# Altium schematic sheet DCU1.SchDoc
size B
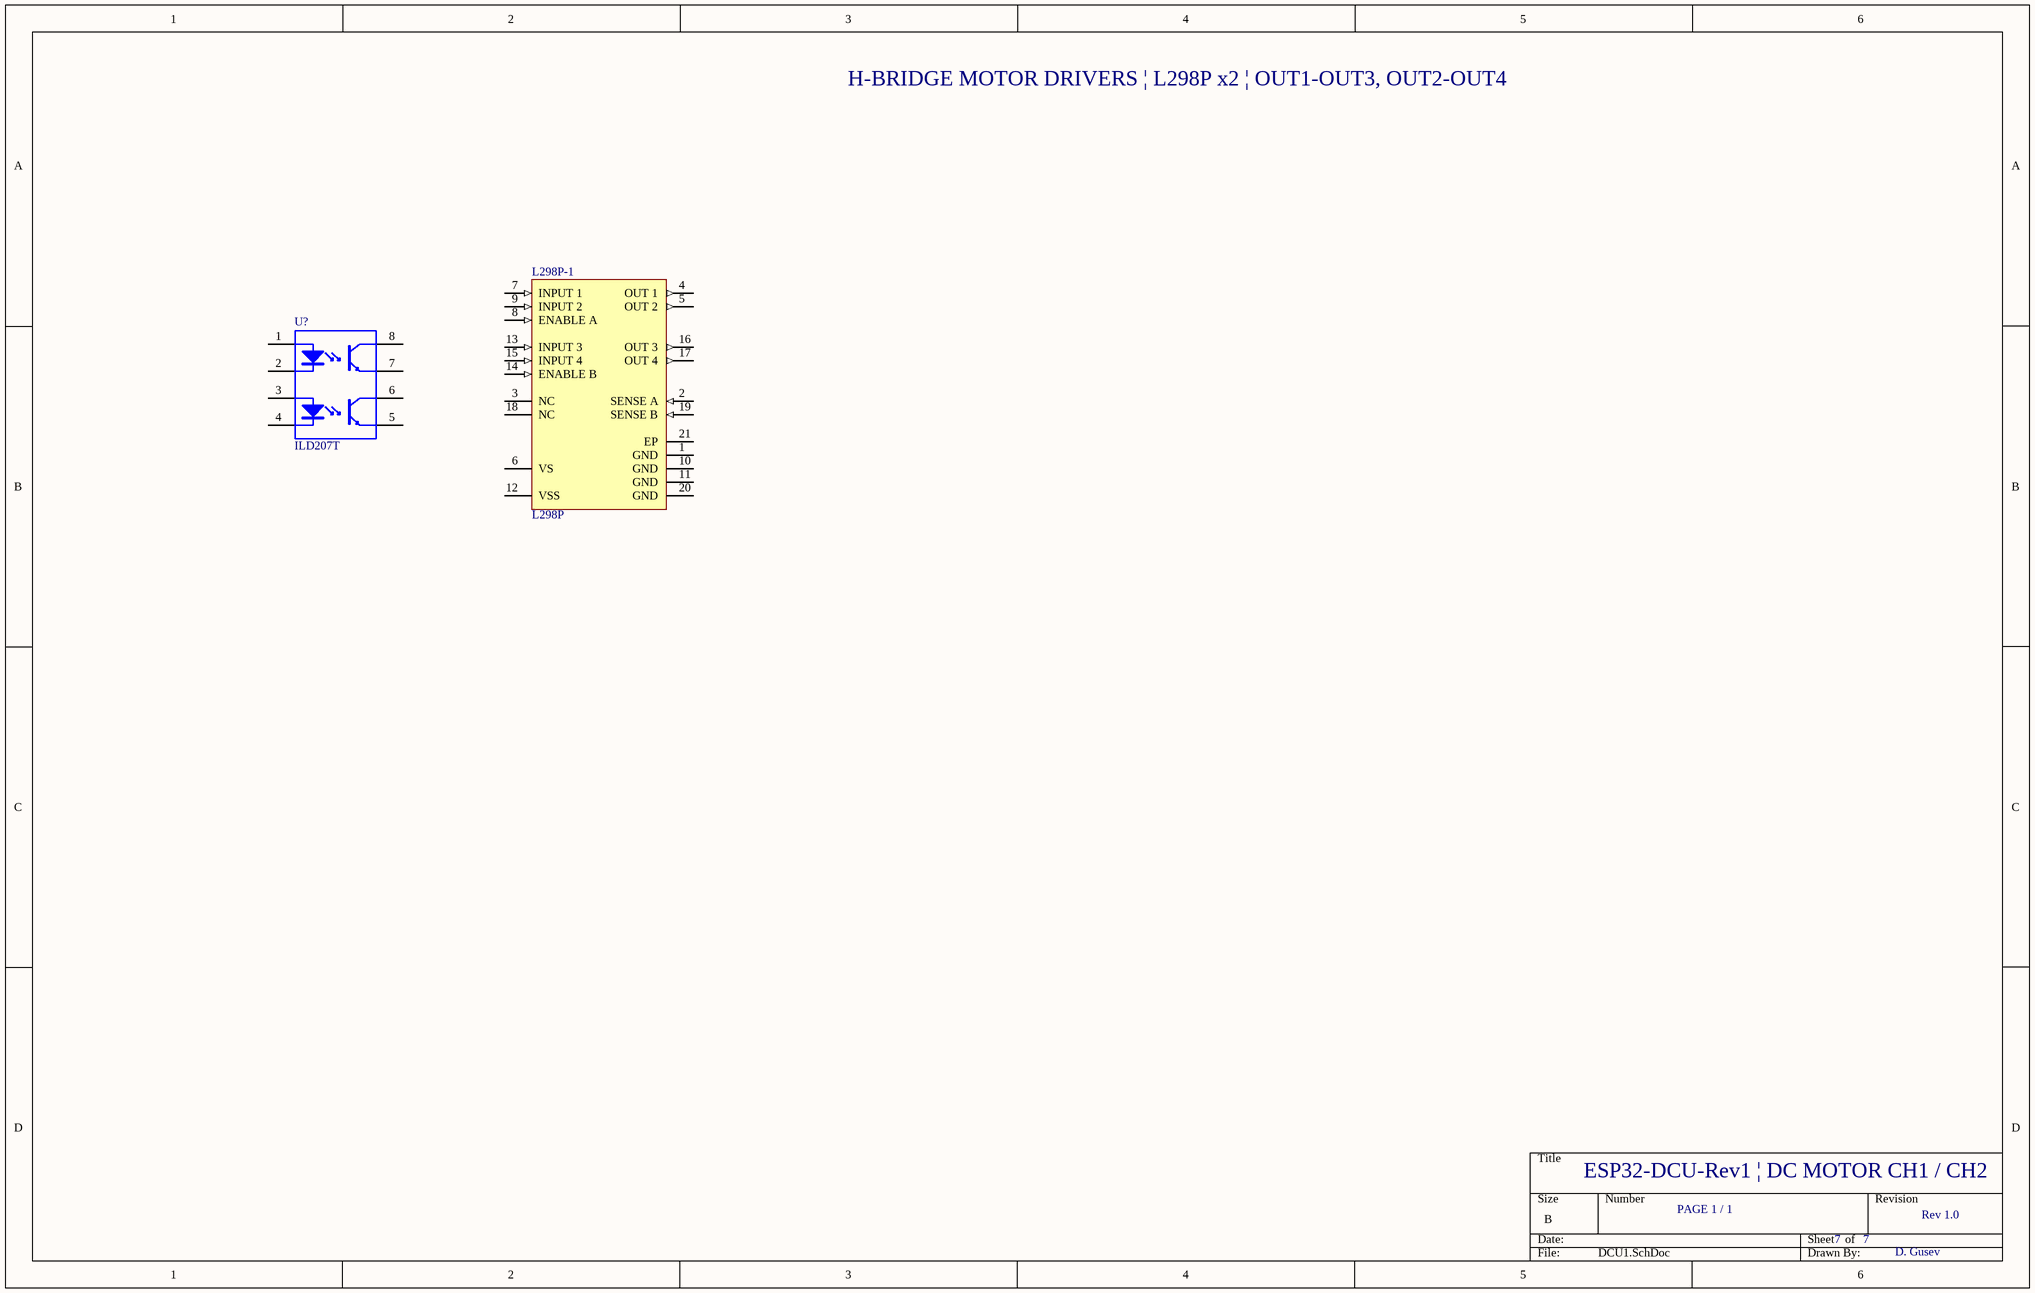
[diagram p0: DCU1.SchDoc]

## Parts
L298P-1  L298P  [STM-PowerSO20_M]
U?  ILD207T  [VISH-SOIC-8_C_V]

## Nets

Not connected (* = marked no-connect by the designer): L298P-1 1(GND) 2(SENSE_A) 3(NC) 4(OUT_1) 5(OUT_2) 6(VS) 7(INPUT_1) 8(ENABLE_A) 9(INPUT_2) 10(GND) 11(GND) 12(VSS) 13(INPUT_3) 14(ENABLE_B) 15(INPUT_4) 16(OUT_3) 17(OUT_4) 18(NC) 19(SENSE_B) 20(GND) 21(EP); U? 1(A) 2(K) 3(A) 4(K) 5(E) 6(C) 7(E) 8(C)

## Notes on the sheet
- H-BRIDGE MOTOR DRIVERS | L298P x2 | OUT1-OUT3, OUT2-OUT4
- ESP32-DCU-Rev1 | DC MOTOR CH1 / CH2
- PAGE 1 / 1
- 7
- Rev 1.0
- D. Gusev

## Library data of the parts
L298P-1 = CMP-2100-03649-1: Dual Full-Bridge Driver, 4.5 to 7 V, -25 to 130 degC, 20-Pin SOIC, RoHS, Tube; Manufacturer: STMicroelectronics; Output Current: 2A; Collector Emitter Voltage (VCEO): 46V; Min Supply Voltage: 4.8V; Max Collector Current: 3A; Supply Voltage: 42V; Number of Channels: 2; Operating Supply Current: 13mA; Packaging: Rail/Tube; Package Reference: PowerSO20; Width: 11.1mm; Radiation Hardening: No; Height: 3.3mm; Lead Free: LeadFree; Datasheet Version: 36526.0; Datasheet URL: http://www.st.com/content/ccc/resource/technical/document/datasheet/82/cc/3f/39/0a/29/4d/f0/CD00000240.pdf/files/CD00000240.pdf/jcr:content/translations/en.CD00000240.pdf; RoHSCompliant: true; Max Supply Voltage: 46V; Output Current per Channel: 2A; Package Description: 20-Pin Small Outline Integrated Circuits, Body 15.9 x 11 mm, Pitch 1.27 mm; Case/Package: SOIC; Min Operating Temperature: -25degC; Number of Pins: 20; Length: 16mm; Max Output Current: 3A; Package Quantity: 31; Max Operating Temperature: 130degC; Mount: SurfaceMount; Manufacturer URL: http://www.st.com/
U? = CMP-2000-06453-1: Optocoupler, Phototransistor Output, Dual Channel, 4000 VRMS, -55 to 100 degC, 8-Pin SOIC, RoHS, Tape and Reel; Manufacturer: Vishay; Voltage - Output (Max): 70V; Vce Saturation (Max): 400mV; Number of Channels: 2; Voltage - Forward (Vf) (Typ): 1.2V; EDA / CAD Models: DownloadfromAcceleratedDesigns; Current Transfer Ratio (Min): 100%@10mA; Current Transfer Ratio (Max): 200%@10mA; Input Type: DC; Current - DC Forward (If) (Max): 30mA; Rise / Fall Time (Typ): 3µs,4.7µs; Turn On / Turn Off Time (Typ): 6µs,5µs; Catalog Drawings: OptocouplerCircuit; Other Names: 751-1310-1ILD207TGICTILD207TGICT-ND; Online Catalog: ILD205T,206T,207T,211T,213T,217TSeries; Mounting Type: SurfaceMount; Package Description: 8-Pin Small Outline Integrated Circuit, Body 5.84 x 3.91 mm, Pitch 1.27 mm; Output Type: Transistor; Package / Case: 8-SOIC(0.154",3.90mmWidth); Category: Isolators; Operating Temperature: -55°C~100°C; Family: Optoisolators-Transistor,PhotovoltaicOutput; Package Reference: SOIC-8; Voltage - Isolation: 4000Vrms; Supplier Device Package: 8-SOIC; Standard Package: 1; Manufacturer URL: http://www.vishay.com/; Series: -; Packaging: CutTape(CT); Datasheet Version: Rev. 2.1, 10/2015; Datasheet URL: http://www.vishay.com/docs/83647/ild205t.pdf; Mounting Technology: SurfaceMount; Current - Output / Channel: -